# Altium project RXv2.PrjPcb
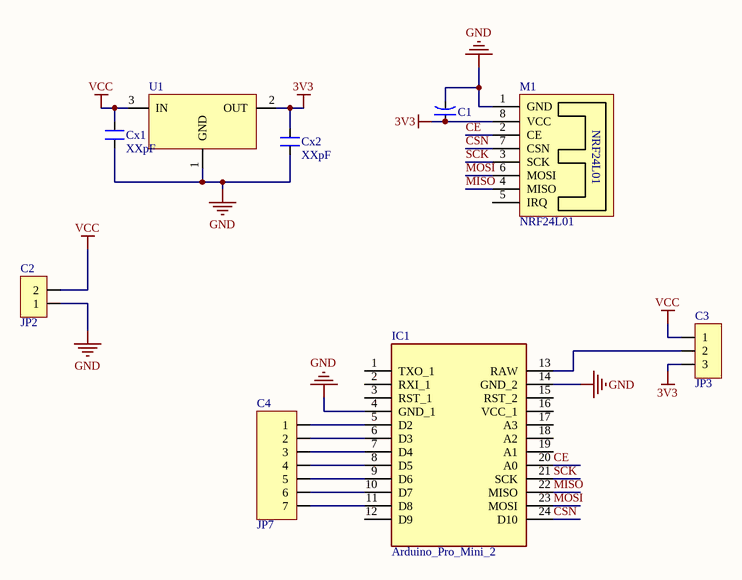
[diagram p0: rx.SchDoc]
1 sheet, 9 parts. Net scope: global (net labels, ports and power ports of the same name join across sheets).
Board file: rxPcb.PcbDoc

## Sheet rx.SchDoc
size A4

### Parts
C1  CN-ALU-DIP  [CA-ALU-2.54]  (value not drawn)
C2  JP2  [JP2-C1T]
C3  JP3  [JP3-CLOSED]
C4  JP7  [JP7-C1T]
Cx1  XXpF  [CN-SMD-1206]
Cx2  XXpF  [CN-SMD-1206]
IC1  Arduino_Pro_Mini_2  [ARDPROMINI 2]
M1  NRF24L01  [NRF24L01]
U1  LM1117-3.3V  [SOT223]  (value not drawn)

### Nets
3V3: C1.1 C3.3 Cx2.2 M1.8(VCC) U1.2(OUT)
GND: C1.2 C2.1 Cx1.1 Cx2.1 IC1.4(GND_1) IC1.14(GND_2) M1.1(GND) U1.1(GND)
VCC: C2.2 C3.1 Cx1.2 U1.3(IN)
CE: IC1.20(A0) M1.2(CE)
CSN: IC1.24(D10) M1.7(CSN)
MISO: IC1.22(MISO) M1.4(MISO)
MOSI: IC1.23(MOSI) M1.6(MOSI)
SCK: IC1.21(SCK) M1.3(SCK)
NetC3_2: C3.2 IC1.13(RAW)
NetC4_1: C4.1 IC1.5(D2)
NetC4_2: C4.2 IC1.6(D3)
NetC4_3: C4.3 IC1.7(D4)
NetC4_4: C4.4 IC1.8(D5)
NetC4_5: C4.5 IC1.9(D6)
NetC4_6: C4.6 IC1.10(D7)
NetC4_7: C4.7 IC1.11(D8)

Not connected (* = marked no-connect by the designer): IC1 1(TXO_1) 2(RXI_1) 3(RST_1) 12(D9) 15(RST_2) 16(VCC_1) 17(A3) 18(A2) 19(A1); M1 5(IRQ)

### Library data of the parts
C1 = CN-ALU-DIP: Capacitor (Semiconductor SIM Model); Value: 104; LatestRevisionDate: 17-Jul-2002; LatestRevisionNote: Re-released for DXP Platform.; PackageReference: C1206; Publisher: Altium Limited
C2 = JP2: WR-PHD 2.54 mm Angled Socket Header; Manufacturer: W¨¹rth Elektronik eiSos GmbH; partNo: 613002143121; ComponentLink1 Description: Manufacturer; ComponentLink2 Description: Datasheet; NoPins: 02; Created Date: 29 March 2013; ComponentLink1URL: http://www.we-online.com; ComponentLink2URL: http://katalog.we-online.de/em/datasheet/6130xx143121.pdf; Created by: Karrer Zheng
C3 = JP3: WR-PHD 2.54 mm Angled Socket Header; Manufacturer: W¨¹rth Elektronik eiSos GmbH; partNo: 613003143121; ComponentLink1 Description: Manufacturer; ComponentLink2 Description: Datasheet; NoPins: 03; Created Date: 29 March 2013; ComponentLink1URL: http://www.we-online.com; ComponentLink2URL: http://katalog.we-online.de/em/datasheet/6130xx143121.pdf; Created by: Karrer Zheng
C4 = JP7: WR-PHD 2.54 mm Angled Socket Header; Manufacturer: W¨¹rth Elektronik eiSos GmbH; partNo: 613007143121; ComponentLink1 Description: Manufacturer; ComponentLink2 Description: Datasheet; NoPins: 07; Created Date: 29 March 2013; ComponentLink1URL: http://www.we-online.com; ComponentLink2URL: http://katalog.we-online.de/em/datasheet/6130xx143121.pdf; Created by: Karrer Zheng
Cx1 Cx2 = CN: Value: 33pF
IC1 = Arduino_Pro_Mini_2: Integrated Circuit; Manufacturer_Name: Gravitech; Manufacturer_Part_Number: ARD-PRO-MINI-5; Datasheet Link: https://www.arduino.cc/en/Main/arduinoBoardProMini; Height: 3mm; Mouser Part Number: 992-ARD-PRO-MINI-5; Mouser Price/Stock: https://www.mouser.co.uk/ProductDetail/Gravitech/ARD-PRO-MINI-5?qs=Vxac6xGyzPmFg4oEKErqiw%3D%3D
U1 = LM1117: 800mA Low-Dropout Linear Regulator; Creator: Nguyen Ba Bien; Website: http://group3i.net